# EAGLE design tasiyiciyolsuz (EAGLE 9.6.2)
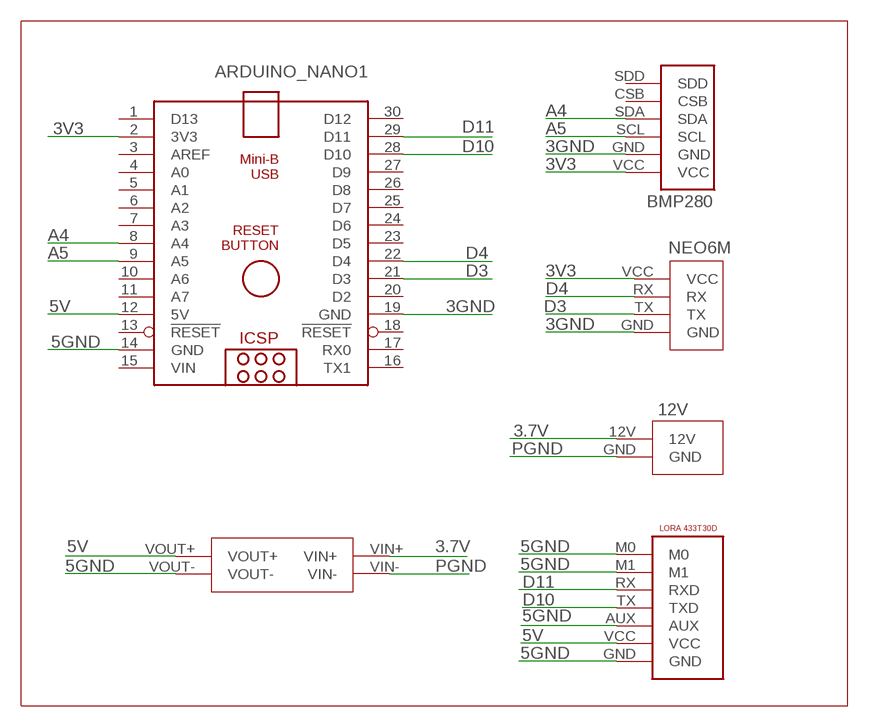
[diagram p0: schematic, sheet 1]

## Parts
ARDUINO_NANO1  ARDUINO_NANO  [ARDUINO_NANO]
BMP1  BMP280  [BMP280]
U$1  12V  [12V]
U$2  LORAFULLSIZE  [LORAFULLSIZE]
U$3  MT3608_REGULATOR  [MT3608_REGULATOR]
U$4  NEO6M  [NEO6M]

## Nets
3.7V: U$1.12V U$3.VIN+
3GND: ARDUINO_NANO1.19(GND) BMP1.GND U$4.GND
3V3: ARDUINO_NANO1.2(3V3) BMP1.VCC U$4.VCC
5GND: ARDUINO_NANO1.14(GND) U$2.AUX U$2.GND U$2.M0 U$2.M1 U$3.VOUT-
5V: ARDUINO_NANO1.12(5V) U$2.VCC U$3.VOUT+
A4: ARDUINO_NANO1.8(A4) BMP1.SDA
A5: ARDUINO_NANO1.9(A5) BMP1.SCL
D3: ARDUINO_NANO1.21(D3) U$4.TX
D4: ARDUINO_NANO1.22(D4) U$4.RX
D10: ARDUINO_NANO1.28(D10) U$2.TX(TXD)
D11: ARDUINO_NANO1.29(D11) U$2.RX(RXD)
PGND: U$1.GND U$3.VIN-
Unconnected: ARDUINO_NANO1.1(D13) ARDUINO_NANO1.3(AREF) ARDUINO_NANO1.4(A0) ARDUINO_NANO1.5(A1) ARDUINO_NANO1.6(A2) ARDUINO_NANO1.7(A3) ARDUINO_NANO1.10(A6) ARDUINO_NANO1.11(A7) ARDUINO_NANO1.13(!RESET) ARDUINO_NANO1.16(TX1) ARDUINO_NANO1.17(RX0) ARDUINO_NANO1.18(!RESET) ARDUINO_NANO1.20(D2) ARDUINO_NANO1.23(D5) ARDUINO_NANO1.24(D6) ARDUINO_NANO1.25(D7) ARDUINO_NANO1.26(D8) ARDUINO_NANO1.27(D9) ARDUINO_NANO1.30(D12) BMP1.CSB BMP1.SDD

## Power pins joined to a net without a drawn wire
VIN: ARDUINO_NANO1.15(VIN)

## Library data of the parts
ARDUINO_NANO1 = ArduinoNanoV30:ARDUINO_NANO: Arduino Nano V3.0 Overview: The Arduino Nano is a small, complete, and breadboard-friendly board based on the ATmega328 (Arduino Nano 3.x) or ATmega168 (Arduino Nano 2.x). It has more or less the same functionality of the Arduino Duemilanove, but in a different package. It lacks only a DC power jack, and works with a Mini-B USB cable instead of a standard one. The Nano was designed and is being produced by Gravitech. Specifications: Microcontroller Atmel ATmega168 or ATmega328 Operating Voltage (logic level) 5 V Input Voltage (recommended) 7-12 V Input Voltage (limits) 6-20 V Digital I/O Pins 14 (of which 6 provide PWM output) Analog Input Pins 8 DC Current per I/O Pin 40 mA Flash Memory 16 KB (ATmega168) or 32 KB (ATmega328) of which 2 KB used by bootloader SRAM 1 KB (ATmega168) or 2 KB (ATmega328) EEPROM 512 bytes (ATmega168) or 1 KB (ATmega328) Clock Speed 16 MHz Dimensions 0.73" x 1.70" Length 45 mm Width 18 mm Weigth 5 g Power: The Arduino Nano can be powered via the Mini-B USB connection, 6-20V unregulated external power supply (pin 30), or 5V regulated external power supply (pin 27). The power source is automatically selected to the highest voltage source. Memory: The ATmega168 has 16 KB of flash memory for storing code (of which 2 KB is used for the bootloader); the ATmega328 has 32 KB, (also with 2 KB used for the bootloader). The ATmega168 has 1 KB of SRAM and 512 bytes of EEPROM (which can be read and written with the EEPROM library); the ATmega328 has 2 KB of SRAM and 1 KB of EEPROM. Input and Output: Each of the 14 digital pins on the Nano can be used as an input or output, using pinMode(), digitalWrite(), and digitalRead() functions. They operate at 5 volts. Each pin can provide or receive a maximum of 40 mA and has an internal pull-up resistor (disconnected by default) of 20-50 kOhms. In addition, some pins have specialized functions. Visit Arduino - ArduinoBoardNano <https://www.arduino.cc/en/Main/ArduinoBoardNano>
BMP1 = SpatiumB:BMP280
U$1 = SpatiumB:12V
U$2 = SpatMuy2022:LORAFULLSIZE
U$3 = SpatMuy2022:MT3608_REGULATOR
U$4 = SpatMuy2022:NEO6M

## Board
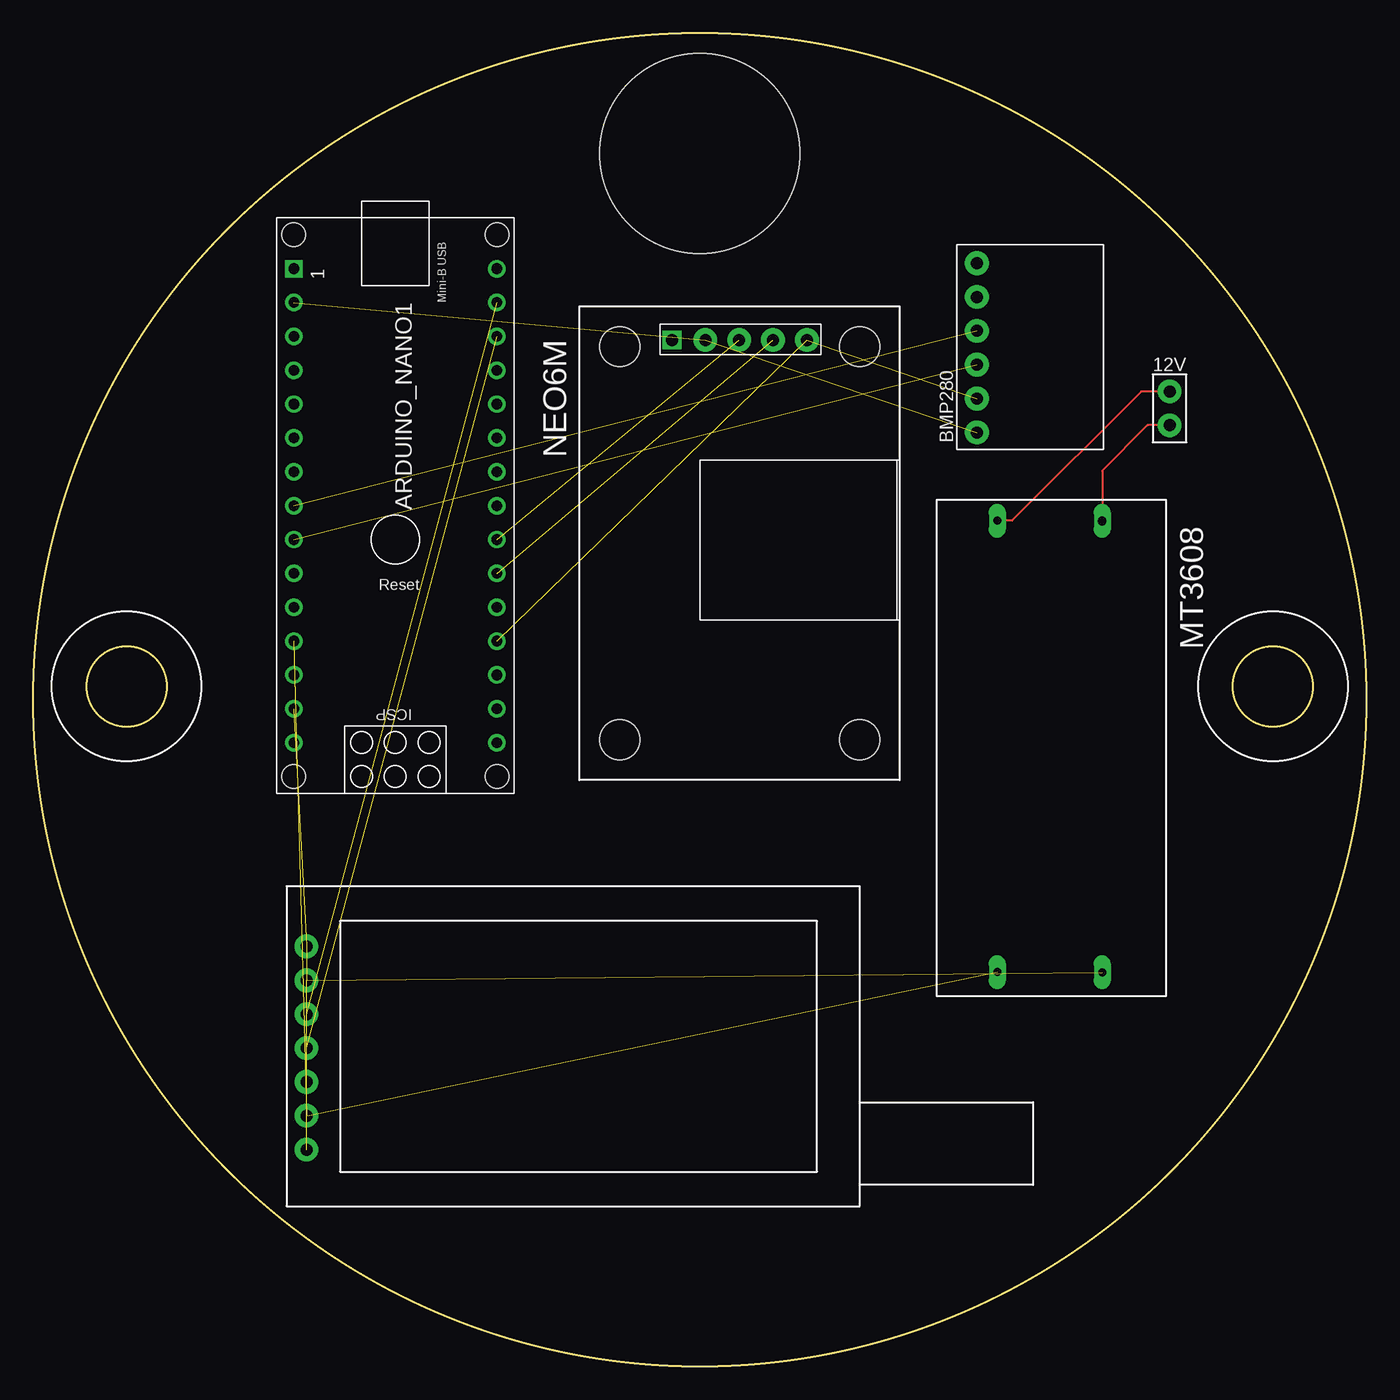
[diagram p1: board, top side]

Size 100 x 100 mm. Coordinates in mm from the lower left corner, seen from the top.
Outline: circle at 50,50 radius 50
Outline: circle at 93,51 radius 3
Outline: circle at 7,51 radius 3
Copper layers (1*16): Top 0.035mm / dielectric 1.5mm / Bottom 0.035mm
Design rules "default": minimum track width 6mil, minimum drill 0.35mm, track to track 6mil, track to pad 6mil, pad to pad 6mil, via to via 6mil, smd to smd 6mil, copper to edge 40mil, drill to drill 6mil, minimum pad ring 10mil, minimum via ring 8mil, stop-mask expansion 4mil, vias tented up to drill 0mil, thermal gap 10mil
Holes 15 mm at 50,91

### Footprints (pad centres in the part's own frame; a part is rotated, then mirrored left to right if it is on the bottom)
ARDUINO_NANO = drill 0.8 square: 1 -20.32,-7.62 | drill 0.8: 2 -17.78,-7.62; 3 -15.24,-7.62; 4 -12.7,-7.62; 5 -10.16,-7.62; 6 -7.62,-7.62; 7 -5.08,-7.62; 8 -2.54,-7.62; 9 0,-7.62; 10 2.54,-7.62; 11 5.08,-7.62; 12 7.62,-7.62; 13 10.16,-7.62; 14 12.7,-7.62; 15 15.24,-7.62; 16 15.24,7.62; 17 12.7,7.62; 18 10.16,7.62; 19 7.62,7.62; 20 5.08,7.62; 21 2.54,7.62; 22 0,7.62; 23 -2.54,7.62; 24 -5.08,7.62; 25 -7.62,7.62; 26 -10.16,7.62; 27 -12.7,7.62; 28 -15.24,7.62; 29 -17.78,7.62; 30 -20.32,7.62 | hole 1.778: -22.86,-7.62; -22.86,7.62; 17.78,7.62; 17.78,-7.62
BMP280 = drill 0.9 pad 1.778: CSB 3.81,3.81; GND -3.81,3.81; SCL -1.27,3.81; SDA 1.27,3.81; SDD 6.35,3.81; VCC -6.35,3.81
12V = drill 0.9 pad 1.778: 12V 0,1.27; GND 0,-1.27
LORAFULLSIZE = drill 0.9 pad 1.778: AUX -10.51,-3.67; GND -10.51,-8.75; M0 -10.51,6.49; M1 -10.51,3.95; RX -10.51,1.41; TX -10.51,-1.13; VCC -10.51,-6.21
MT3608_REGULATOR = drill 0.6 pad 1.27 long: VIN+ -3.43,-7.67; VOUT+ 30.43,-7.67; VOUT- 30.45,0.19 | drill 0.65 pad 1.27 long: VIN- -3.41,0.19
NEO6M = drill 0.9 pad 1.778: GND 0,-7.04; RX 0,-1.96; TX 0,-4.5; VCC 0,0.58 | drill 0.9 pad 1.422 square: P$1 0,3.08 | hole 3: -0.5,-11; -30,-11; -30,7; -0.5,7

### Placement (x,y rotation side)
ARDUINO_NANO1  27.16,62.02 270 top
BMP1  74.6,76.41 90 top
U$1  85.25,71.86 0 top
U$2  31,25 0 top
U$3  80,60 270 top
U$4  51,77 90 top

### Tracks (layer width: path | path; a pad name or v marks a point on that pad's centre or on a via)
3.7V
  Top 0.152: U$1.12V 83.13,73.13 73.43,63.43 U$3.VIN+
3GND  (2 unrouted)
3V3  (2 unrouted)
5GND  (5 unrouted)
5V  (2 unrouted)
A4  (1 unrouted)
A5  (1 unrouted)
D3  (1 unrouted)
D4  (1 unrouted)
D10  (1 unrouted)
D11  (1 unrouted)
PGND
  Top 0.152: U$1.GND 83.59,70.59 80.19,67.19 U$3.VIN-